# EAGLE schematic trafficHV-v1 (EAGLE 5.06)
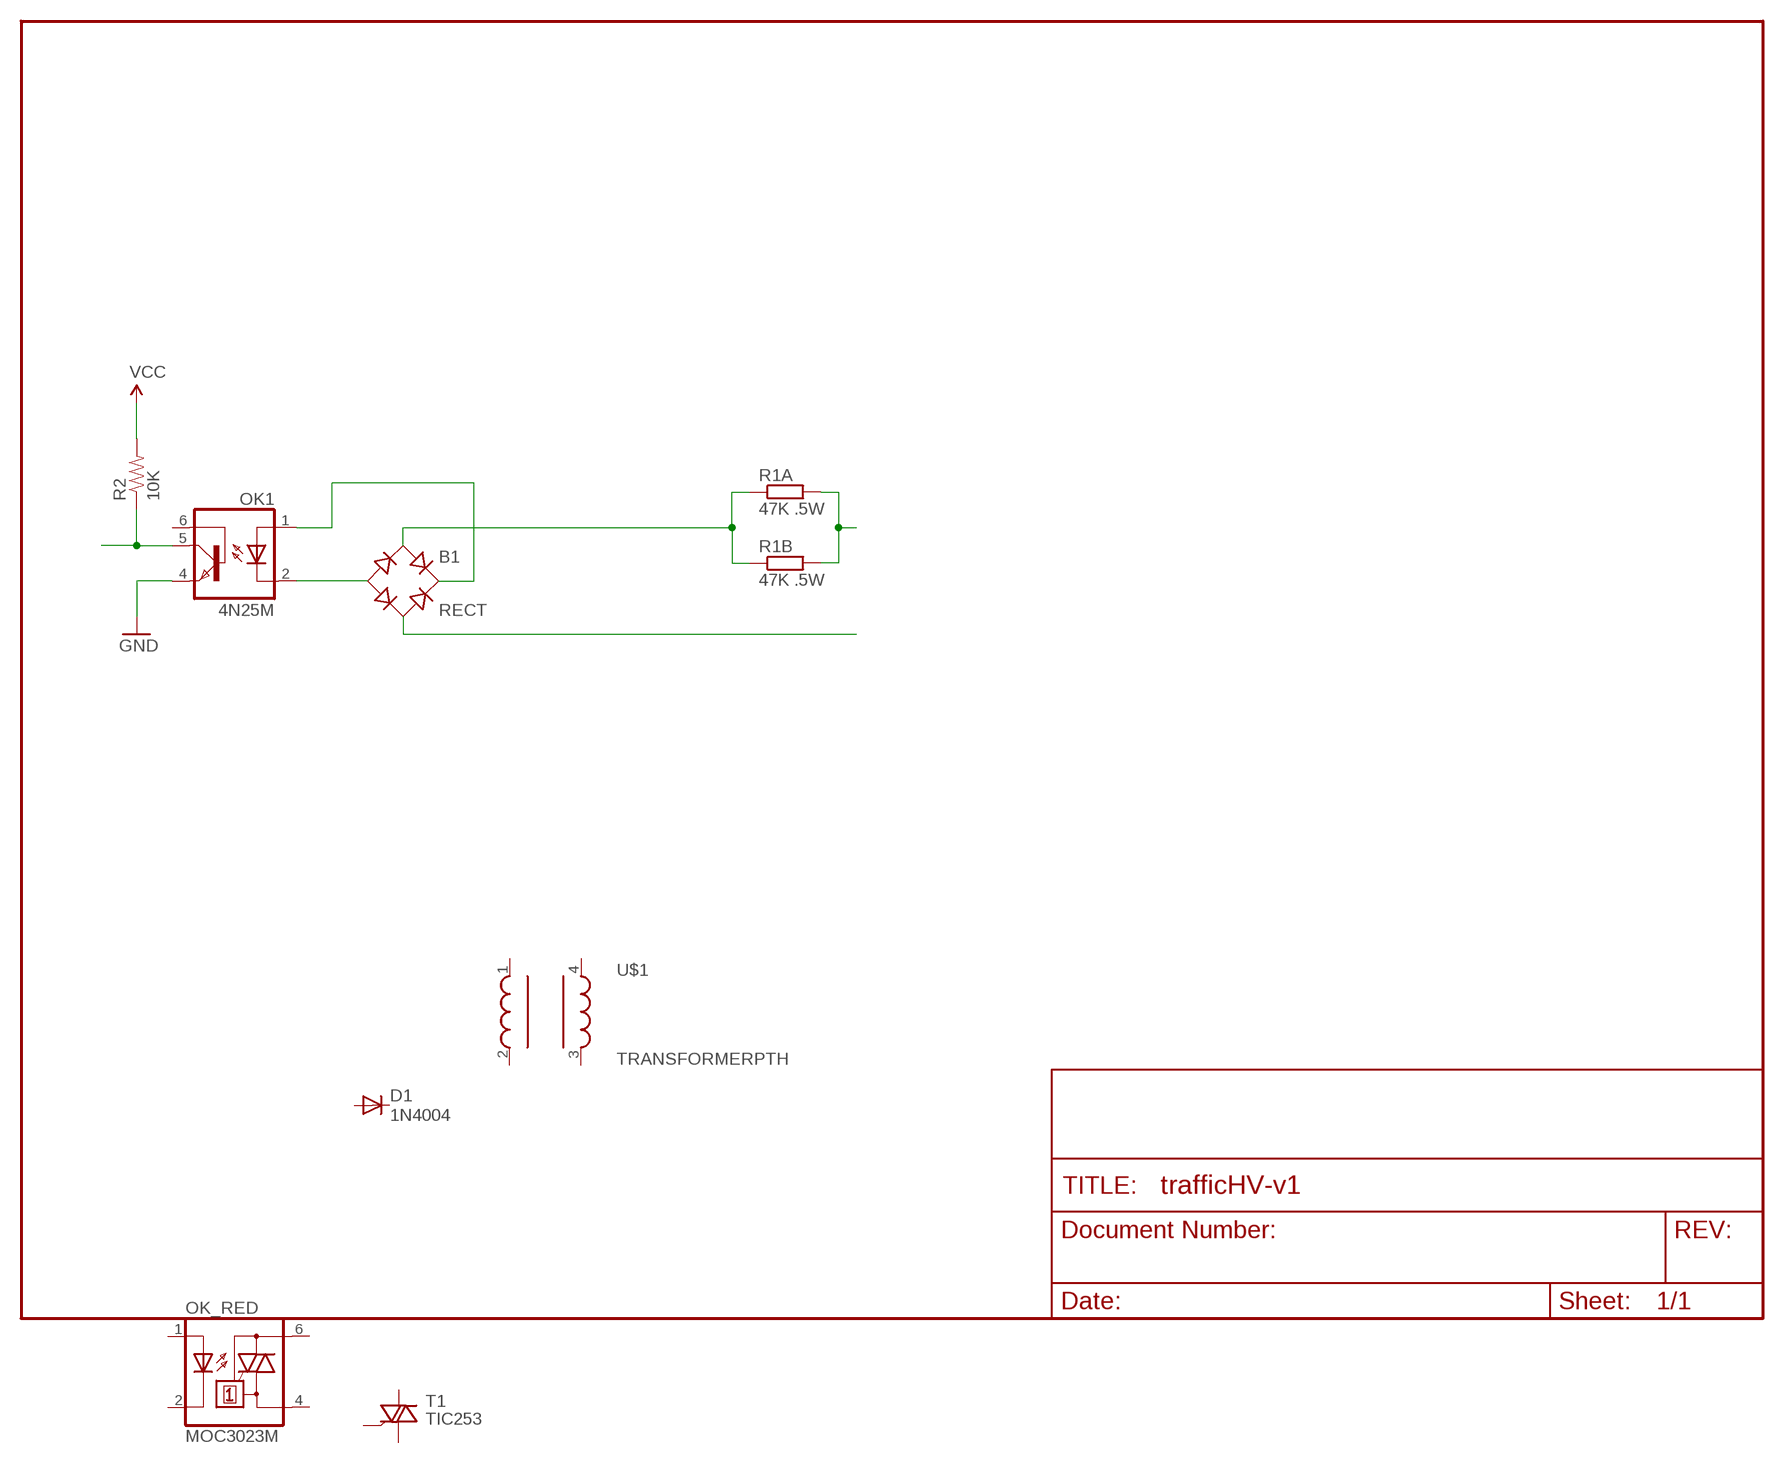
[diagram p0: schematic, sheet 1]

## Parts
B1  RECT  RECTIFIER-1KAB  [1KAB]
D1  1N4004  [DO41-10]
OK1  4N25M  [DIL06]
OK_RED  MOC3023M  [DIL06]
R1A  47K .5W  R-EU_0613/5V  [P0613V]
R1B  47K .5W  R-EU_0613/5V  [P0613V]
R2  10K  RESISTORPTH1  [AXIAL-0.3]
T1  TIC253  [TO218DS]
U$1  TRANSFORMERPTH  [TRANSFORMER]

## Nets
GND: OK1.4(EMI)
N$1: B1.AC1 R1A.1 R1B.1
N$2: B1.+ OK1.1(A)
N$3: B1.- OK1.2(C)
N$4: R1A.2 R1B.2
N$5: B1.AC2
N$6: OK1.5(COL) R2.P$1
VCC: R2.P$2
Unconnected: D1.A D1.C OK1.6(BAS) OK_RED.1(A) OK_RED.2(C) OK_RED.4(A1) OK_RED.6(A2) T1.A1 T1.A2 T1.G U$1.1 U$1.2 U$1.3 U$1.4

## Library data of the parts
B1 = rectifier:RECTIFIER-: Rectifier
D1 = diode:1N4004: DIODE general purpose rectifier, 1 A
OK1 = optocoupler:4N*?M: General Purpose 6-Pin Phototransistor Optocouplers Source: http://www.fairchildsemi.com/ds/4N/4N35-M.pdf
OK_RED = optocoupler:MOC30*M: RANDOM-PHASE OPTOISOLATORS TRIAC DRIVER OUTPUT Source: http://www.fairchildsemi.com MOC3020-M.pdf
R1A R1B = resistor:R-EU_: RESISTOR, European symbol
R2 = SparkFun:RESISTOR: Resistor Basic schematic elements and footprints for 0603, 1206, and PTH 1/10th watt (small) resistors.
T1 = triac:TIC253: TRIAC
U$1 = SparkFun:TRANSFORMER